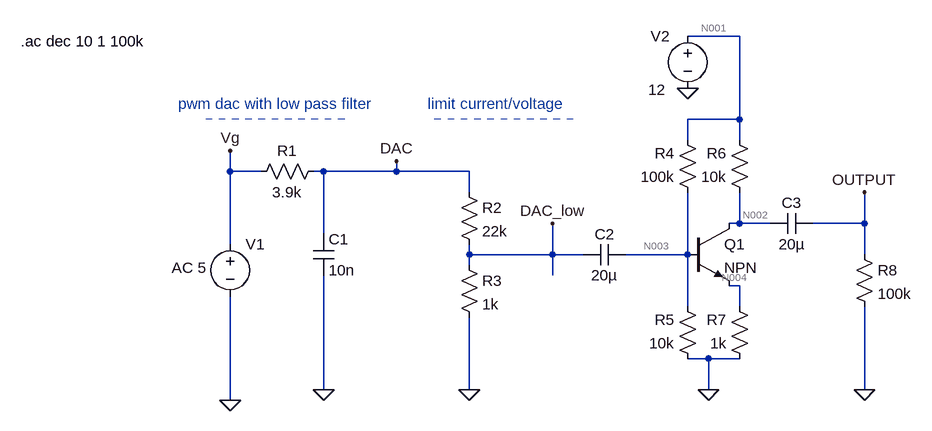
[diagram p0: schematic pwmDAC_preamp.asc]
pwmDAC_preamp.asc, the LTspice schematic file:
Version 4
SHEET 1 980 680
WIRE 704 -208 624 -208
WIRE 704 -80 704 -208
WIRE 704 -80 624 -80
WIRE 624 -48 624 -80
WIRE 704 -48 704 -80
WIRE -80 0 -80 -32
WIRE -32 0 -80 0
WIRE 64 0 48 0
WIRE 176 0 176 -16
WIRE 176 0 64 0
WIRE 288 0 176 0
WIRE 288 32 288 0
WIRE 704 80 704 32
WIRE 704 80 688 80
WIRE 752 80 704 80
WIRE 896 80 896 32
WIRE 896 80 816 80
WIRE 64 96 64 0
WIRE -80 112 -80 0
WIRE 288 128 288 112
WIRE 416 128 416 80
WIRE 416 128 288 128
WIRE 464 128 416 128
WIRE 624 128 624 32
WIRE 624 128 528 128
WIRE 896 128 896 80
WIRE 288 144 288 128
WIRE 416 160 416 128
WIRE 704 176 688 176
WIRE 624 208 624 128
WIRE 704 208 704 176
WIRE 656 288 624 288
WIRE 704 288 656 288
WIRE 64 336 64 160
WIRE 288 336 288 224
WIRE 656 336 656 288
WIRE 896 336 896 208
WIRE -80 352 -80 192
FLAG -80 352 0
FLAG -80 -32 Vg
FLAG 656 336 0
FLAG 896 336 0
FLAG 624 -128 0
FLAG 416 80 DAC_low
FLAG 896 32 OUTPUT
FLAG 288 336 0
FLAG 64 336 0
FLAG 176 -16 DAC
SYMBOL voltage -80 96 R0
WINDOW 3 -70 83 Left 2
WINDOW 123 -90 52 Left 2
WINDOW 39 0 0 Left 2
SYMATTR InstName V1
SYMATTR Value ""
SYMATTR Value2 AC 5
SYMBOL res -48 16 R270
WINDOW 0 32 56 VTop 2
WINDOW 3 0 56 VBottom 2
SYMATTR InstName R1
SYMATTR Value 3.9k
SYMBOL res 272 16 R0
SYMATTR InstName R2
SYMATTR Value 22k
SYMBOL res 272 128 R0
SYMATTR InstName R3
SYMATTR Value 1k
SYMBOL cap 464 144 R270
WINDOW 0 32 32 VTop 2
WINDOW 3 0 32 VBottom 2
SYMATTR InstName C2
SYMATTR Value 20µ
SYMBOL res 640 48 R180
WINDOW 0 36 76 Left 2
WINDOW 3 36 40 Left 2
SYMATTR InstName R4
SYMATTR Value 100k
SYMBOL res 640 304 R180
WINDOW 0 36 76 Left 2
WINDOW 3 36 40 Left 2
SYMATTR InstName R5
SYMATTR Value 10k
SYMBOL res 720 48 R180
WINDOW 0 36 76 Left 2
WINDOW 3 36 40 Left 2
SYMATTR InstName R6
SYMATTR Value 10k
SYMBOL res 720 304 R180
WINDOW 0 36 76 Left 2
WINDOW 3 36 40 Left 2
SYMATTR InstName R7
SYMATTR Value 1k
SYMBOL npn 624 80 R0
SYMATTR InstName Q1
SYMBOL res 880 112 R0
SYMATTR InstName R8
SYMATTR Value 100k
SYMBOL voltage 624 -224 R0
WINDOW 0 -57 16 Left 2
WINDOW 3 -61 98 Left 2
WINDOW 123 0 0 Left 2
WINDOW 39 0 0 Left 2
SYMATTR InstName V2
SYMATTR Value 12
SYMBOL cap 752 96 R270
WINDOW 0 32 32 VTop 2
WINDOW 3 0 32 VBottom 2
SYMATTR InstName C3
SYMATTR Value 20µ
SYMBOL cap 48 96 R0
SYMATTR InstName C1
SYMATTR Value 10n
TEXT -402 -200 Left 2 !.ac dec 10 1 100k
TEXT -160 -104 Left 2 ;pwm dac with low pass filter
TEXT 224 -104 Left 2 ;limit current/voltage
LINE Normal 96 -80 -128 -80 2
LINE Normal 96 -80 96 -80 2
LINE Normal 448 -80 224 -80 2

The netlist it stands for:
* pwmDAC_preamp.asc
V1 Vg 0 AC 5
R1 Vg DAC 3.9k
R2 DAC DAC_low 22k
R3 DAC_low 0 1k
C2 DAC_low N003 20µ
R4 N003 N001 100k
R5 0 N003 10k
R6 N002 N001 10k
R7 0 N004 1k
Q1 N002 N003 N004 0 NPN
R8 OUTPUT 0 100k
V2 N001 0 12
C3 N002 OUTPUT 20µ
C1 DAC 0 10n
.model NPN NPN
.model PNP PNP
.lib standard.bjt
.ac dec 10 1 100k
* pwm dac with low pass filter
* limit current/voltage
.backanno
.end

* Results of the author's LTspice run, read from the files saved beside the schematic
* Operating Point, zero values left out:
*   V(n003) = 1.062 V
*   V(n001) = 12 V
*   V(n002) = 8.852 V
*   V(n004) = 318 mV
*   Ic(Q1) = 314.8 µA
*   Ib(Q1) = 3.148 µA
*   Ie(Q1) = -318 µA
*   I(R7) = -318 µA
*   I(R6) = -314.8 µA
*   I(R5) = -106.2 µA
*   I(R4) = -109.4 µA
*   I(V2) = -424.2 µA
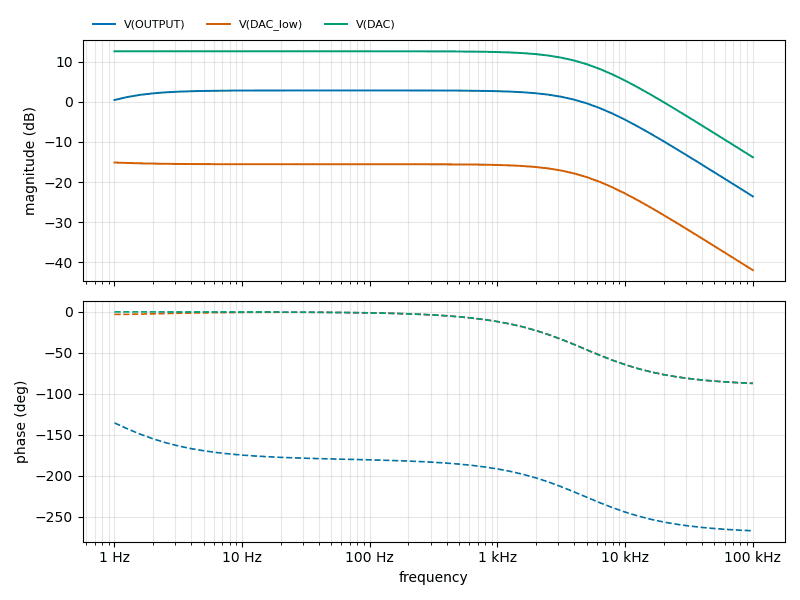
[diagram p1: AC Analysis of pwmDAC_preamp.asc, plotted from the saved traces]
* AC Analysis, 1 run:
*   V(OUTPUT): 0.46 dB at 1 Hz, -23.58 dB at 100 kHz, peak 2.85 dB at 63.1 Hz, 3 dB below the peak at 4.756 kHz
*   V(DAC_low): -15.14 dB at 1 Hz, -41.99 dB at 100 kHz, peak -15.14 dB at 1 Hz, 3 dB below the peak at 4.285 kHz
*   V(DAC): 12.62 dB at 1 Hz, -13.82 dB at 100 kHz, peak 12.62 dB at 1 Hz, 3 dB below the peak at 4.751 kHz